# Altium project BUCK3524.PrjPcb
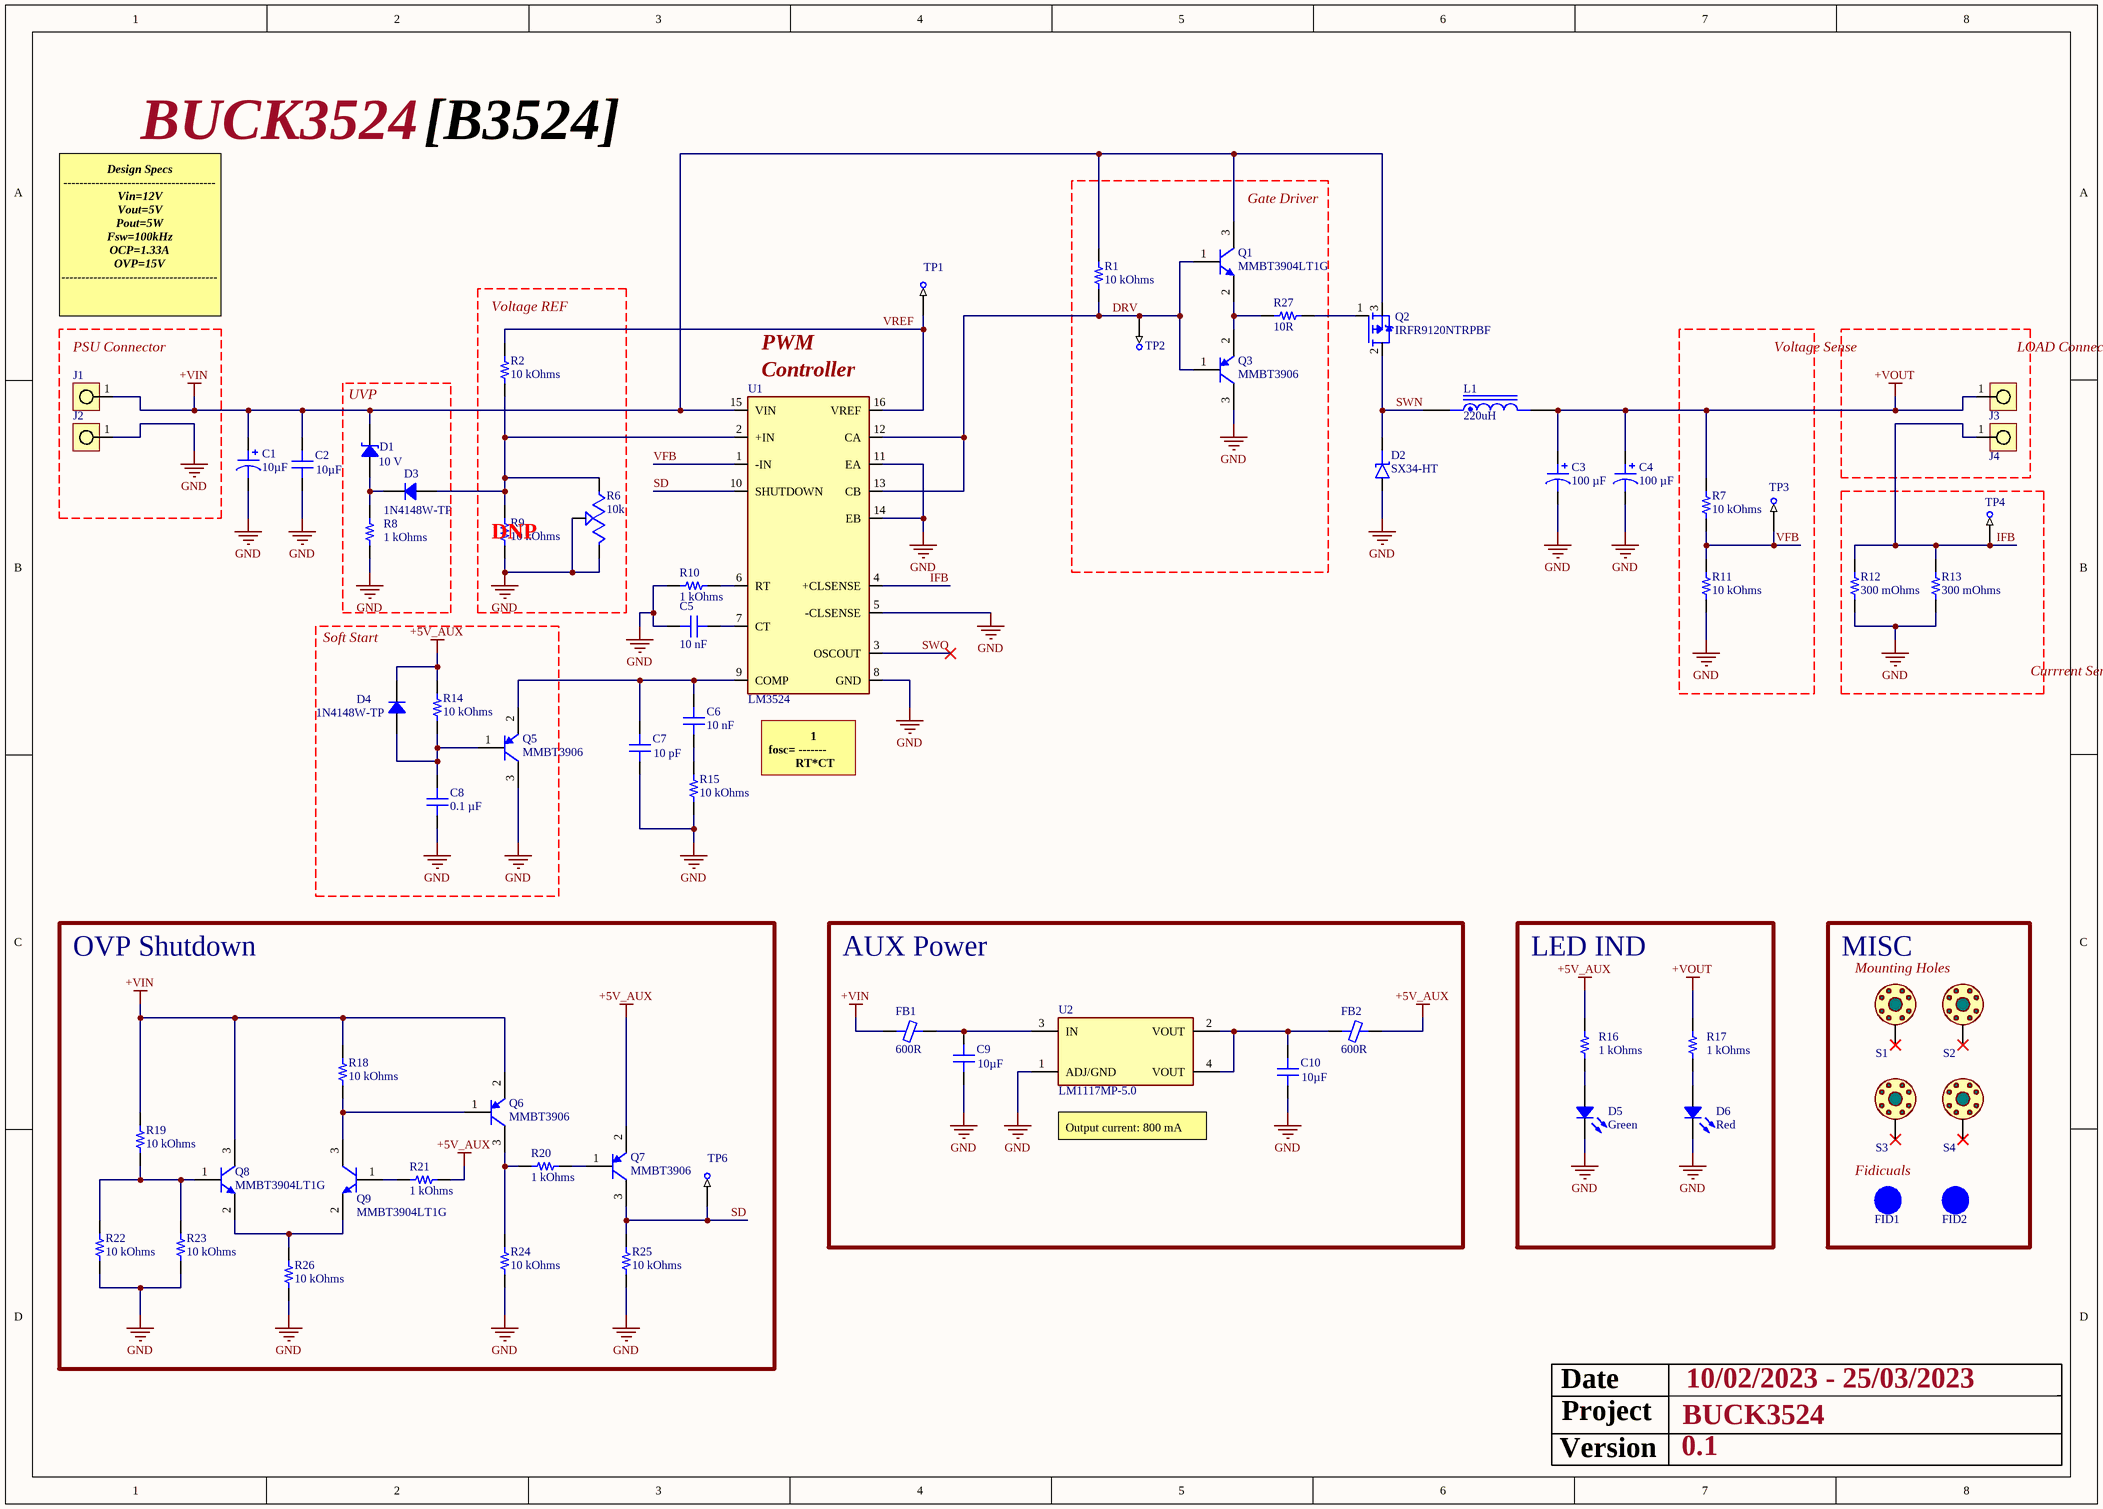
[diagram p0: [1] - POWER.SchDoc]
Project: BUCK3524; VersionRevision: 0.1
1 sheet, 68 parts. Net scope: global (net labels, ports and power ports of the same name join across sheets).
Board file: BUCK3524PCB.PcbDoc

## Sheet [1] - POWER.SchDoc
size A3

### Parts
C1  10µF  [CAP ALSMD POLY 4.3MM H5.5MM]
C2  10µF  [CAP 1206_3216 - 0.8MM]
C3  100 µF  [CAP ALSMD 6.6MM H5.4MM]
C4  100 µF  [CAP ALSMD 6.6MM H5.4MM]
C5  10 nF  [CAP 1206_3216 - 0.8MM]
C6  10 nF  [CAP 1206_3216 - 0.8MM]
C7  10 pF  [CAP 1206_3216 - 0.8MM]
C8  0.1 µF  [CAP 1206_3216 - 0.8MM]
C9  10µF  [CAP 1206_3216 - 0.8MM]
C10  10µF  [CAP 1206_3216 - 0.8MM]
D1  Voltage - Zener (Nom) (Vz): 10 V  [DIODES SOT-323-3]  (hidden comment: BZX84W-B10F)
D2  SX34-HT  [DO-214AC-2 (SMA)]
D3  1N4148W-TP  [SOD-123]
D4  1N4148W-TP  [SOD-123]
D5  Green  [LED 1206_3216 GREEN]
D6  Red  [LED 1206_3216 RED]
FB1  600R  [FER 1206_3216]
FB2  600R  [FER 1206_3216]
FID1  Fidicual  [Fidicual]  (value not drawn)  (no BOM)
FID2  Fidicual  [Fidicual]  (value not drawn)  (no BOM)
J1  SOLDER_PIN_THT  [SOLDER_PIN_THT_1_5]  (value not drawn)
J2  SOLDER_PIN_THT  [SOLDER_PIN_THT_1_5]  (value not drawn)
J3  SOLDER_PIN_THT  [SOLDER_PIN_THT_1_5]  (value not drawn)
J4  SOLDER_PIN_THT  [SOLDER_PIN_THT_1_5]  (value not drawn)
L1  value 220uH  [IND_B82477R4224M100]  (hidden comment: SRI1204)
Q1  MMBT3904LT1G  [ON SEMI SOT-23-3]
Q2  IRFR9120NTRPBF  [DPAK]
Q3  MMBT3906  [ON SEMI SOT-23-3 - duplicate]
Q5  MMBT3906  [ON SEMI SOT-23-3 - duplicate]
Q6  MMBT3906  [ON SEMI SOT-23-3 - duplicate]
Q7  MMBT3906  [ON SEMI SOT-23-3 - duplicate]
Q8  MMBT3904LT1G  [ON SEMI SOT-23-3]
Q9  MMBT3904LT1G  [ON SEMI SOT-23-3]
R1  10 kOhms  [RES 1206_3216]
R2  10 kOhms  [RES 1206_3216]
R6  10k  [TRIM_3386P-1-101T]
R7  10 kOhms  [RES 1206_3216]
R8  1 kOhms  [RES 1206_3216]
R9  10 kOhms  [RES 1206_3216]
R10  1 kOhms  [RES 1206_3216]
R11  10 kOhms  [RES 1206_3216]
R12  300 mOhms  [RES 2512_6432]
R13  300 mOhms  [RES 2512_6432]
R14  10 kOhms  [RES 1206_3216]
R15  10 kOhms  [RES 1206_3216]
R16  1 kOhms  [RES 1206_3216]
R17  1 kOhms  [RES 1206_3216]
R18  10 kOhms  [RES 1206_3216]
R19  10 kOhms  [RES 1206_3216]
R20  1 kOhms  [RES 1206_3216]
R21  1 kOhms  [RES 1206_3216]
R22  10 kOhms  [RES 1206_3216]
R23  10 kOhms  [RES 1206_3216]
R24  10 kOhms  [RES 1206_3216]
R25  10 kOhms  [RES 1206_3216]
R26  10 kOhms  [RES 1206_3216]
R27  10R  [RES 1206_3216]
S1  Screw  [MY_PAD_3MM]  (value not drawn)  (net tie, no BOM)
S2  Screw  [MY_PAD_3MM]  (value not drawn)  (net tie, no BOM)
S3  Screw  [MY_PAD_3MM]  (value not drawn)  (net tie, no BOM)
S4  Screw  [MY_PAD_3MM]  (value not drawn)  (net tie, no BOM)
TP1  net?  [MY_TestPin]  (value not drawn)  (no BOM)
TP2  net?  [MY_TestPin]  (value not drawn)  (no BOM)
TP3  net?  [MY_TestPin]  (value not drawn)  (no BOM)
TP4  net?  [MY_TestPin]  (value not drawn)  (no BOM)
TP6  net?  [MY_TestPin]  (value not drawn)  (no BOM)
U1  LM3524  [DIL16]
U2  LM1117MP-5.0  [SOT230P700X180-4N]

### Blocks framed on the sheet
Gate Driver: Q1 Q3 R1 R27 TP2
PSU Connector: J1 J2
DNP: R2 R6 R9
Voltage Sense: R7 R11 TP3
LOAD Connector: J3 J4
UVP: D1 D3 R8
Currrent Sense: R12 R13 TP4
Soft Start: C8 D4 Q5 R14
OVP Shutdown: Q6-Q9 R18-R26 TP6
AUX Power: C9 C10 FB1 FB2 U2
LED IND: D5 D6 R16 R17
MISC: FID1 FID2 S1-S4

### Nets
+5V_AUX: D4.2 FB2.2 Q7.2(C) R14.2 R16.2 R21.2
+VIN: C1.1 C2.2 D1.2 FB1.1 J1.1 Q1.3(C) Q2.3(S) Q6.2(C) Q8.3(C) R1.2 R18.2 R19.2 U1.15(VIN)
+VOUT: C3.1 C4.1 J3.1 L1.2 R7.2 R17.2
GND: C1.2 C2.1 C3.2 C4.2 C5.1 C7.1 C8.1 C9.1 C10.1 D2.A D5.2 D6.2 J2.1 Q3.3(E) Q5.3(E) R6.1(CCW) R6.2(WIPER) R8.1 R9.1 R10.2 R11.1 R12.1 R13.1 R15.2 R22.1 R23.1 R24.1 R25.1 R26.1 U1.5(-CLSENSE) U1.8(GND) U1.11(EA) U1.14(EB) U2.1(ADJ/GND)
DRV: Q1.1(B) Q3.1(B) R1.1 TP2.1 U1.12(CA) U1.13(CB)
IFB: J4.1 R12.2 R13.2 TP4.1 U1.4(+CLSENSE)
SD: Q7.3(E) R25.2 TP6.1 U1.10(SHUTDOWN)
SWN: D2.K L1.1 Q2.2(D)
SWO: U1.3(OSCOUT)
VFB: R7.1 R11.2 TP3.1 U1.1(-IN)
VREF: R2.2 TP1.1 U1.16(VREF)
NetC5_2: C5.2 U1.7(CT)
NetC6_1: C6.1 R15.1
NetC6_2: C6.2 C7.2 Q5.2(C) U1.9(COMP)
NetC8_2: C8.2 D4.1 Q5.1(B) R14.1
NetC9_2: C9.2 FB1.2 U2.3(IN)
NetC10_2: C10.2 FB2.1 U2.2(VOUT) U2.4(VOUT)
NetD1_1: D1.1 D3.2 R8.2
NetD3_1: D3.1 R2.1 R6.3(CW) R9.2 U1.2(+IN)
NetD5_1: D5.1 R16.1
NetD6_1: D6.1 R17.1
NetQ1_2: Q1.2(E) Q3.2(C) R27.1
NetQ2_1: Q2.1(G) R27.2
NetQ6_1: Q6.1(B) Q9.3(C) R18.1
NetQ6_3: Q6.3(E) R20.2 R24.2
NetQ7_1: Q7.1(B) R20.1
NetQ8_1: Q8.1(B) R19.1 R22.2 R23.2
NetQ8_2: Q8.2(E) Q9.2(E) R26.2
NetQ9_1: Q9.1(B) R21.1
NetR10_1: R10.1 U1.6(RT)

Not connected (* = marked no-connect by the designer): S1 0*; S2 0*; S3 0*; S4 0*

### Notes on the sheet
- [B3524]
- Design Specs
  --------------------------------------
  Vin=12V
  Vout=5V
  Pout=5W
  Fsw=100kHz
  OCP=1.33A
  OVP=15V
  ---------------------------------------
- (near R2) Voltage REF
- PWM
- (near U1) Controller
- (near U1) 1
  fosc= -------
  RT*CT
- Mounting Holes
- (near U2) Output current: 800 mA
- (near FID1) Fidicuals
- Date
- 10/02/2023 - 25/03/2023
- Project
- Version

### Library data of the parts
C1 = UWR1E100MCL1GB: CAP ALUM 10UF 20% 25V SMD; Manufacturer: Nichicon; Lifetime @ Temp.: 2000 Hrs @ 85°C; Polarization: Polar; Ripple Current @ High Frequency: 40.5mA @ 10kHz; Ripple Current @ Low Frequency: 27mA @ 120Hz; Surface Mount Land Size: 0.169" L x 0.169" W (4.30mm x 4.30mm); Part Number: UWR1E100MCL1GB; Applications: General Purpose; Capacitance: 10µF; ComponentLink1Description: Datasheet; ComponentLink1URL: https://products.nichicon.co.jp/en/pdf/XJA043/e-uwx.pdf; ComponentLink2Description: DigiKey Link; ComponentLink2URL: http://digikey.com/product-detail/en/nichicon/UWR1E100MCL1GB/493-17501-1-ND/8582493; Device Package: Radial, Can - SMD; Height - Seated (Max): 0.217" (5.50mm); LastUpdated: 9/2/2020 1:23:43 AM; Lifecycle Status: Active; Minimum Order: 1; Mounting Type: Surface Mount; Operating Temperature: -40°C ~ 85°C; Package / Case: Radial, Can - SMD; Packaging: TapeAndReel; PartId: 7448; Part Status: Active; Price: 0.07; Series: UWR; Size / Dimension: 0.157" Dia (4.00mm); Supplier 1: DigiKey; Supplier Part Number 1: 493-17501-1-ND; Tolerance: ±20%; Value: 10µF; Voltage - Rated: 25V
C2 C9 C10 = CL31A106KACLNNC: CAP CER 10UF 25V X5R 1206; manufacturer: Samsung Electro-Mechanics; Tolerance: ±10%; Part Number: CL31A106KACLNNC; Value: 10µF; Applications: General Purpose; Capacitance: 10µF; componentlink1description: Datasheet; componentlink1url: http://www.samsungsem.com/kr/support/product-search/mlcc/CL31A106KACLNNC.jsp; componentlink2description: DigiKey Link; componentlink2url: https://www.digikey.com/en/products/detail/samsung-electro-mechanics/CL31A106KACLNNC/3888378; Device Package: 1206 (3216 Metric); Features: Low Profile; lastupdated: 19.09.2022 13:06:35; Lifecycle Status: Active; Minimum Order: 1; Mounting Type: Surface Mount, MLCC; Operating Temperature: -55°C ~ 85°C; Package / Case: 1206 (3216 Metric); packaging: TapeAndReel; partid: 20311; Part Status: Active; price: 0.04; series: CL; Size / Dimension: 0.126" L x 0.063" W (3.20mm x 1.60mm); Supplier 1: DigiKey; Supplier Part Number 1: 1276-2720-1-ND; Temperature Coefficient: X5R; Thickness (Max): 0.037" (0.95mm); Voltage - Rated: 25V
C3 C4 = UCW1E101MCL1GS: CAP ALUM 100UF 20% 25V SMD; manufacturer: Nichicon; Impedance: 1 Ohms; Lifetime @ Temp.: 7000 Hrs @ 105°C; Polarization: Polar; Ripple Current @ High Frequency: 230 mA @ 100 kHz; Ripple Current @ Low Frequency: 115 mA @ 120 Hz; Surface Mount Land Size: 0.260" L x 0.260" W (6.60mm x 6.60mm); Part Number: UCW1E101MCL1GS; Applications: General Purpose; Capacitance: 100 µF; componentlink1description: Datasheet; componentlink1url: http://nichicon-us.com/english/products/pdfs/e-ucw.pdf; componentlink2description: DigiKey Link; componentlink2url: https://www.digikey.com/en/products/detail/nichicon/UCW1E101MCL1GS/2549775; Device Package: Radial, Can - SMD; Height - Seated (Max): 0.343" (8.70mm); lastupdated: 19.09.2022 13:45:21; Lifecycle Status: Active; Minimum Order: 1; Mounting Type: Surface Mount; Operating Temperature: -25°C ~ 105°C; Package / Case: Radial, Can - SMD; packaging: TapeAndReel; partid: 26995; Part Status: Active; price: 0.20; series: UCW; Size / Dimension: 0.248" Dia (6.30mm); Supplier 1: DigiKey; Supplier Part Number 1: 493-9418-1-ND; Tolerance: ±20%; value: 100 µF; Voltage - Rated: 25 V
C5 C6 = C1206C103F3GECAUTO: CAP CER 1206 10NF 25V C0G 1%; manufacturer: KEMET; Capacitance: 10000 pF; Temperature Coefficient: C0G, NP0; Part Number: C1206C103F3GECAUTO; Value: 10 nF; Applications: Automotive, ESD Protection; componentlink1description: Datasheet; componentlink1url: https://api.kemet.com/component-edge/download/datasheet/C1206C103F3GECAUTO.pdf; componentlink2description: DigiKey Link; componentlink2url: https://www.digikey.com/en/products/detail/kemet/C1206C103F3GECAUTO/8647500; Device Package: 1206 (3216 Metric); Features: Low ESL; lastupdated: 19.09.2022 13:06:10; Lifecycle Status: Active; Minimum Order: 1; Mounting Type: Surface Mount, MLCC; Operating Temperature: -55°C ~ 125°C; Package / Case: 1206 (3216 Metric); packaging: TapeAndReel; partid: 30341; Part Status: Active; price: 0.67; Ratings: AEC-Q200; series: ESD SMD Auto C0G; Size / Dimension: 0.126" L x 0.063" W (3.20mm x 1.60mm); Supplier 1: DigiKey; Supplier Part Number 1: 399-C1206C103F3GECAUTOCT-ND; Thickness (Max): 0.039" (1.00mm); Tolerance: ±1%; Voltage - Rated: 25V
C7 = CC1206JRNPO9BN100: CAP CER 10PF 50V C0G/NPO 1206; manufacturer: Yageo; Temperature Coefficient: C0G, NP0; Tolerance: ±5%; Part Number: CC1206JRNPO9BN100; Value: 10 pF; Applications: General Purpose; Capacitance: 10 pF; componentlink1description: Datasheet; componentlink1url: https://www.yageo.com/upload/media/product/productsearch/datasheet/mlcc/UPY-GP_NP0_16V-to-50V_17.pdf; componentlink2description: DigiKey Link; componentlink2url: https://www.digikey.com/en/products/detail/yageo/CC1206JRNPO9BN100/302884; Device Package: 1206 (3216 Metric); lastupdated: 19.09.2022 13:06:45; Lifecycle Status: Active; Minimum Order: 1; Mounting Type: Surface Mount, MLCC; Operating Temperature: -55°C ~ 125°C; Package / Case: 1206 (3216 Metric); packaging: TapeAndReel; partid: 18732; Part Status: Active; price: 0.04; series: CC; Size / Dimension: 0.126" L x 0.063" W (3.20mm x 1.60mm); Supplier 1: DigiKey; Supplier Part Number 1: 311-1150-1-ND; Thickness (Max): 0.024" (0.60mm); Voltage - Rated: 50V
C8 = C1206C104K8RAC7800: CAP CER 0.1UF 10V X7R 1206; manufacturer: KEMET; Tolerance: ±10%; Part Number: C1206C104K8RAC7800; Value: 0.1 µF; Applications: Bypass, Decoupling; Capacitance: 0.1 µF; componentlink1description: Datasheet; componentlink1url: https://api.kemet.com/component-edge/download/datasheet/C1206C104K8RACTU.pdf; componentlink2description: DigiKey Link; componentlink2url: https://www.digikey.com/en/products/detail/kemet/C1206C104K8RAC7800/2215080; Device Package: 1206 (3216 Metric); lastupdated: 19.09.2022 13:06:45; Lifecycle Status: Active; Minimum Order: 1; Mounting Type: Surface Mount, MLCC; Operating Temperature: -55°C ~ 125°C; Package / Case: 1206 (3216 Metric); packaging: TapeAndReel; partid: 19429; Part Status: Active; price: 0.08; series: SMD Comm X7R; Size / Dimension: 0.126" L x 0.063" W (3.20mm x 1.60mm); Supplier 1: DigiKey; Supplier Part Number 1: 399-15539-1-ND; Temperature Coefficient: X7R; Thickness (Max): 0.035" (0.88mm); Voltage - Rated: 10V
D1 = BZX84W-B10F: DIODE ZENER 10V 275MW SOT323; Manufacturer: Nexperia USA Inc.; Current - Reverse Leakage @ Vr: 200 nA @ 7 V; Impedance (Max) (Zzt): 20 Ohms; Tolerance: ±2%; Voltage - Forward (Vf) (Max) @ If: 900 mV @ 10 mA; Part Number: BZX84W-B10F; ComponentLink1Description: Datasheet; ComponentLink1URL: https://assets.nexperia.com/documents/data-sheet/BZX84W_SER.pdf; ComponentLink2Description: DigiKey Link; ComponentLink2URL: https://www.digikey.com/en/products/detail/nexperia-usa-inc/BZX84W-B10F/9380664; LastUpdated: 19.09.2022 13:51:24; Lifecycle Status: Active; Minimum Order: 1; Mounting Type: Surface Mount; Operating Temperature: 150°C (TJ); Package / Case: SC-70, SOT-323; Packaging: TapeAndReel; PartId: 793; Part Status: Active; Power - Max: 275 mW; Price: 0.02; Series: Automotive, AEC-Q101; Supplier 1: DigiKey; Supplier Part Number 1: 1727-8249-1-ND; Supplier Device Package: SOT-323
D2 = D_SCHOTTKY_SMA: Diode Schottky SMD SMA (DO-214AA); Manufacturer: Hottech; Manufacturer Part Number: 17155
D3 D4 = 1N4148W-TP: DIODE GEN PURP 100V 150MA SOD123; Manufacturer: Micro Commercial Co; Current - Reverse Leakage @ Vr: 1µA @ 75V; Diode Type: Standard; Reverse Recovery Time (trr): 4ns; Speed: Small Signal =< 200mA (Io), Any Speed; Voltage - Forward (Vf) (Max) @ If: 1.25V @ 150mA; Part Number: 1N4148W-TP; ComponentLink1Description: Datasheet; ComponentLink1URL: https://www.mccsemi.com/pdf/Products/1N4148W(SOD123).pdf; ComponentLink2Description: DigiKey Link; ComponentLink2URL: http://digikey.com/product-detail/en/micro-commercial-co/1N4148W-TP/1N4148WTPMSCT-ND/717311; Current - Average Rectified (Io): 150mA; LastUpdated: 9/2/2020 1:19:08 AM; Lifecycle Status: Active; Minimum Order: 1; Mounting Type: Surface Mount; Operating Temperature - Junction: -65°C ~ 150°C; Package / Case: SOD-123; Packaging: TapeAndReel; PartId: 999; Part Status: Active; Price: 0.03; Series: -; Supplier 1: DigiKey; Supplier Part Number 1: 1N4148WTPMSCT-ND; Supplier Device Package: SOD-123; Voltage - DC Reverse (Vr) (Max): 100V
D5 = SML-LX1206GW-TR: LED GREEN DIFFUSED 1206 SMD; Manufacturer: Lumex Opto/Components Inc.; Configuration: Standard; Current - Test: 20mA; Lens Color: White; Lens Size: 2.00mm x 1.60mm; Lens Style: Rectangle with Flat Top; Millicandela Rating: 10mcd; Viewing Angle: 160°; Voltage - Forward (Vf) (Typ): 2.2V; Wavelength - Peak: 565nm; Part Number: SML-LX1206GW-TR; Color: Green; ComponentLink1Description: Datasheet; ComponentLink1URL: https://www.lumex.com/content/files/ProductAttachment/SML-LX1206GW-TR.pdf; ComponentLink2Description: DigiKey Link; ComponentLink2URL: https://www.digikey.com/en/products/detail/lumex-opto-components-inc/SML-LX1206GW-TR/270798; Device Package: 1206 (3216 Metric); Height (Max): 1.10mm; LastUpdated: 19.09.2022 13:50:05; Lens Transparency: Diffused; Lifecycle Status: Active; Minimum Order: 1; Mounting Type: Surface Mount; Package / Case: 1206 (3216 Metric); Packaging: TapeAndReel; PartId: 572; Part Status: Active; Price: 0.09; Series: -; Size / Dimension: 3.20mm L x 1.60mm W; Supplier 1: DigiKey; Supplier Part Number 1: 67-1002-1-ND; Supplier Device Package: 1206; Value: Green
D6 = SML-LX1206IW-TR: LED RED DIFFUSED 1206 SMD; Manufacturer: Lumex Opto/Components Inc.; Configuration: Standard; Current - Test: 20mA; Lens Color: White; Lens Size: 2.00mm x 1.60mm; Lens Style: Rectangle with Flat Top; Millicandela Rating: 6mcd; Viewing Angle: 160°; Voltage - Forward (Vf) (Typ): 2V; Wavelength - Peak: 635nm; Part Number: SML-LX1206IW-TR; Color: Red; ComponentLink1Description: Datasheet; ComponentLink1URL: https://www.lumex.com/content/files/ProductAttachment/SML-LX1206IW-TR.pdf; ComponentLink2Description: DigiKey Link; ComponentLink2URL: https://www.digikey.com/en/products/detail/lumex-opto-components-inc/SML-LX1206IW-TR/270800; Device Package: 1206 (3216 Metric); Height (Max): 1.10mm; LastUpdated: 19.09.2022 13:50:50; Lens Transparency: Diffused; Lifecycle Status: Active; Minimum Order: 1; Mounting Type: Surface Mount; Package / Case: 1206 (3216 Metric); Packaging: TapeAndReel; PartId: 192; Part Status: Active; Price: 0.07; Series: -; Size / Dimension: 3.20mm L x 1.60mm W; Supplier 1: DigiKey; Supplier Part Number 1: 67-1003-1-ND; Supplier Device Package: 1206; Value: Red
FB1 FB2 = BLM31KN601BH1L: 600OHM DCR MAX 2) A RATED CURREN; Manufacturer: Murata Electronics; Current Rating (Max): 2A; DC Resistance (DCR) (Max): 38mOhm; Filter Type: Power Line; Number of Lines: 1; Part Number: BLM31KN601BH1L; ComponentLink1Description: Datasheet; ComponentLink1URL: https://www.murata.com/en-global/products/productdata/8800169623582/QNFA9138.pdf; ComponentLink2Description: DigiKey Link; ComponentLink2URL: http://digikey.com/product-detail/en/murata-electronics/BLM31KN601BH1L/490-18087-1-ND/9559599; Device Package: 1206 (3216 Metric); Height (Max): 0.071" (1.80mm); LastUpdated: 2.09.2020 01:18:24; Lifecycle Status: Active; Minimum Order: 1; Mounting Type: Surface Mount; Operating Temperature: -55°C ~ 150°C; Package / Case: 1206 (3216 Metric); Packaging: TapeAndReel; PartId: 1583; Part Status: Active; Price: 0.10; Ratings: AEC-Q200; Series: EMIFIL®, BLM31; Size / Dimension: 0.126" L x 0.063" W (3.20mm x 1.60mm); Supplier 1: DigiKey; Supplier Part Number 1: 490-18087-1-ND
J1-J4 = SOLDER_PIN_THT: Solder Pin 1.5mm Through-Hole
L1 = SRI1204: 220uH 12X12 1.3A; MP: B82477R4224M100; MF: TDK; Package: None; Purchase-URL: https://pricing.snapeda.com/search/part/B82477R4224M100/?ref=eda; SnapEDA_Link: https://www.snapeda.com/parts/B82477R4224M100/TDK/view-part/?ref=snap; Availability: In Stock; Check_prices: https://www.snapeda.com/parts/B82477R4224M100/TDK/view-part/?ref=eda; Price: None
Q1 Q8 Q9 = MMBT3904LT1G: TRANS NPN 40V 0.2A SOT23; Manufacturer: ON Semiconductor; Current - Collector (Ic) (Max): 200mA; DC Current Gain (hFE) (Min) @ Ic, Vce: 100 @ 10mA, 1V; Frequency - Transition: 300MHz; Power - Max: 300mW; Vce Saturation (Max) @ Ib, Ic: 300mV @ 5mA, 50mA; Part Number: MMBT3904LT1G; ComponentLink1Description: Datasheet; ComponentLink1URL: http://www.onsemi.com/pub/Collateral/MMBT3904LT1-D.PDF; ComponentLink2Description: DigiKey Link; ComponentLink2URL: http://digikey.com/product-detail/en/on-semiconductor/MMBT3904LT1G/MMBT3904LT1GOSCT-ND/1139813; LastUpdated: 9/2/2020 1:30:08 AM; Lifecycle Status: Active; Minimum Order: 1; Mounting Type: Surface Mount; Operating Temperature: -55°C ~ 150°C (TJ); Package / Case: TO-236-3, SC-59, SOT-23-3; Packaging: TapeAndReel; PartId: 168; Part Status: Active; Price: 0.02; Series: -; Supplier 1: DigiKey; Supplier Part Number 1: MMBT3904LT1GOSCT-ND; Supplier Device Package: SOT-23-3 (TO-236); Transistor Type: NPN; Voltage - Collector Emitter Breakdown (Max): 40V
Q2 = IRFR9120NTRPBF: RoHS Compliant | Low RDS(on) | Industry-leading quality | Dynamic dv/dt Rating | Fast Switching | Fully Avalanche Rated | 175C Operating Temperature | P-Channel MOSFET; MF: Infineon Technologies; Price: None; SnapEDA_Link: https://www.snapeda.com/parts/IRFR9120NTRPBF/Infineon+Technologies/view-part/?ref=snap; Purchase-URL: https://pricing.snapeda.com/search/part/IRFR9120NTRPBF/?ref=eda; Value: *; MP: IRFR9120NTRPBF; Availability: In Stock; Package: TO-252-3 International Rectifier; Check_prices: https://www.snapeda.com/parts/IRFR9120NTRPBF/Infineon+Technologies/view-part/?ref=eda
Q3 Q5-Q7 = MMBT3906: MMBT3906 Series 40 V 0.2 A 350 mW PNP General Purpose Amplifier - SOT-23; Published: 8-Jun-2000; LatestRevisionDate: 11-Dec-2002; LatestRevisionNote: Sim Port Map correction; DatasheetVersion: Nov-1997; PackageReference: TO-18; Publisher: Altium Limited; PackageDescription: Can; 3 Leads; Pin Circle Dia. 2.54 mm; Lead Dia. 0.49 mm (max); ComponentLink1Description: Manufacturer Link; ComponentLink1URL: http://www.st.com/; ComponentLink2Description: Datasheet; ComponentLink2URL: http://www.st.com/stonline/products/literature/ds/9037/2n2905a.pdf
R1 R2 R7 R9 R11 R14 R15 R18 R19 R22-R26 = CRG1206F10K: RES SMD 10K OHM 1% 1/4W 1206; Manufacturer: TE Connectivity Passive Product; Power (Watts): 0.25W, 1/4W; Temperature Coefficient: ±100ppm/°C; Part Number: CRG1206F10K; ComponentLink1Description: Datasheet; ComponentLink1URL: https://www.te.com/commerce/DocumentDelivery/DDEController?Action=srchrtrv&DocNm=1773204&DocType=DS&DocLang=English; ComponentLink2Description: DigiKey Link; ComponentLink2URL: http://digikey.com/product-detail/en/te-connectivity-passive-product/CRG1206F10K/A106069CT-ND/3477720; Composition: Thick Film; Device Package: 1206 (3216 Metric); Height - Seated (Max): 0.026" (0.65mm); LastUpdated: 9/2/2020 1:13:10 AM; Lifecycle Status: Active; Minimum Order: 1; Number of Terminations: 2; Operating Temperature: -55°C ~ 155°C; Package / Case: 1206 (3216 Metric); Packaging: TapeAndReel; PartId: 26989; Part Status: Active; Price: 0.01; Resistance: 10 kOhms; Series: CRG, Neohm; Size / Dimension: 0.122" L x 0.061" W (3.10mm x 1.55mm); Supplier 1: DigiKey; Supplier Part Number 1: A106069CT-ND; Supplier Device Package: 1206; Tolerance: ±1%; Value: 10 kOhms
R6 = 3386P-1-101T: 10k Ohms 0.5W, 1/2W PC Pins Through Hole Trimmer Potentiometer Cermet 1 Turn Top Finger Adjustment; MF: Bourns; Price: None; MP: 3386P-1-101T; Package: NON-STANDARD-3 Bourns; Value: 10k; Purchase-URL: https://pricing.snapeda.com/search/part/3386P-1-101T/?ref=eda; Availability: In Stock; SnapEDA_Link: https://www.snapeda.com/parts/3386P-1-101T/Bourns/view-part/?ref=snap; Check_prices: https://www.snapeda.com/parts/3386P-1-101T/Bourns/view-part/?ref=eda
R8 R10 R16 R17 R20 R21 = CRG1206F1K0: RES SMD 1K OHM 1% 1/4W 1206; Manufacturer: TE Connectivity Passive Product; Power (Watts): 0.25W, 1/4W; Temperature Coefficient: ±100ppm/°C; Part Number: CRG1206F1K0; ComponentLink1Description: Datasheet; ComponentLink1URL: https://www.te.com/commerce/DocumentDelivery/DDEController?Action=srchrtrv&DocNm=1773204&DocType=DS&DocLang=English; ComponentLink2Description: DigiKey Link; ComponentLink2URL: http://digikey.com/product-detail/en/te-connectivity-passive-product/CRG1206F1K0/A106070CT-ND/3477722; Composition: Thick Film; Device Package: 1206 (3216 Metric); Height - Seated (Max): 0.026" (0.65mm); LastUpdated: 9/2/2020 1:13:10 AM; Lifecycle Status: Active; Minimum Order: 1; Number of Terminations: 2; Operating Temperature: -55°C ~ 155°C; Package / Case: 1206 (3216 Metric); Packaging: TapeAndReel; PartId: 26986; Part Status: Active; Price: 0.01; Resistance: 1 kOhms; Series: CRG, Neohm; Size / Dimension: 0.122" L x 0.061" W (3.10mm x 1.55mm); Supplier 1: DigiKey; Supplier Part Number 1: A106070CT-ND; Supplier Device Package: 1206; Tolerance: ±1%; Value: 1 kOhms
R12 R13 = RLP73K3AR30FTDF: RES 0.3 OHM 1% 2W 2512; Manufacturer: TE Connectivity Passive Product; Temperature Coefficient: ±200ppm/°C; Part Number: RLP73K3AR30FTDF; ComponentLink1Description: Datasheet; ComponentLink1URL: https://www.te.com/commerce/DocumentDelivery/DDEController?Action=srchrtrv&DocNm=1773269&DocType=DS&DocLang=English; ComponentLink2Description: DigiKey Link; ComponentLink2URL: http://digikey.com/product-detail/en/te-connectivity-passive-product/RLP73K3AR30FTDF/A109705CT-ND/4032471; Composition: Thick Film; Device Package: 2512 (6432 Metric); Features: Current Sense; Height - Seated (Max): 0.033" (0.84mm); LastUpdated: 2.09.2020 01:26:56; Lifecycle Status: Active; Minimum Order: 1; Number of Terminations: 2; Operating Temperature: -55°C ~ 155°C; Package / Case: 2512 (6432 Metric); Packaging: TapeAndReel; Part Status: Active; Power (Watts): 2W; Price: 0.22; Resistance: 300 mOhms; Series: RL73, CGS; Size / Dimension: 0.250" L x 0.124" W (6.35mm x 3.15mm); Supplier 1: DigiKey; Supplier Part Number 1: A109705CT-ND; Supplier Device Package: 2512; Tolerance: ±1%; Value: 300 mOhms
R27 = CRGCQ1206F10R: RES 10 OHM 1% 1/4W 1206; Manufacturer: TE Connectivity Passive Product; Power (Watts): 0.25W, 1/4W; Temperature Coefficient: ±400ppm/°C; Part Number: CRGCQ1206F10R; ComponentLink1Description: Datasheet; ComponentLink1URL: https://www.te.com/commerce/DocumentDelivery/DDEController?Action=srchrtrv&DocNm=1773204-3&DocType=DS&DocLang=English; ComponentLink2Description: DigiKey Link; ComponentLink2URL: https://www.digikey.com/en/products/detail/te-connectivity-passive-product/CRGCQ1206F10R/8576388; Composition: Thick Film; Device Package: 1206 (3216 Metric); Features: Automotive AEC-Q200, Moisture Resistant; Height - Seated (Max): 0.026" (0.65mm); LastUpdated: 19.09.2022 13:29:56; Lifecycle Status: Active; Minimum Order: 1; Number of Terminations: 2; Operating Temperature: -55°C ~ 155°C; Package / Case: 1206 (3216 Metric); Packaging: TapeAndReel; PartId: 27003; Part Status: Active; Price: 0.01; Ratings: AEC-Q200; Resistance: 10R; Series: CRGCQ; Size / Dimension: 0.122" L x 0.061" W (3.10mm x 1.55mm); Supplier 1: DigiKey; Supplier Part Number 1: A129786CT-ND; Supplier Device Package: 1206; Tolerance: ±1%; Value: 10R
S1-S4 = Screw: 3mm Screw; ASiD Part Number: Screw-AS
TP1-TP4 TP6 = Test Point: ASiD Part Number: Test Point-AS
U1 = LM3524: Buck, Boost Regulator Positive or Negative Output Step-Up, Step-Down DC-DC Controller IC 16-SOIC; MF: Texas Instruments; Price: None; Package: SOIC-16 National Semiconductor; MP: LM3524; Value: *; Availability: Unavailable; SnapEDA_Link: https://www.snapeda.com/parts/LM3524/Texas%20Instruments/view-part/559291/?ref=snap
U2 = LM1117MP-5.0: Space Saving 800mA Low-Dropout Linear Regulator with Internal Current Limit; MF: Texas Instruments; MP: LM1117MP-5.0/NOPB; DigiKey-Purchase-URL: https://snapeda.com/shop?store=DigiKey&id=22380; Package: SOT-223-4 Texas Instruments; Mouser-Purchase-URL: https://snapeda.com/shop?store=Mouser&id=22380; Value: *; SnapEDA_Link: https://www.snapeda.com/parts/LM1117MP-5.0/NOPB/Texas%20Instruments/view-part/22380/?ref=snap; Availability: Unavailable; Price: None; Texas_Instruments-Purchase-URL: https://snapeda.com/shop?store=Texas+Instruments&id=22380